# EAGLE design EspPinExtender (EAGLE 6.1)
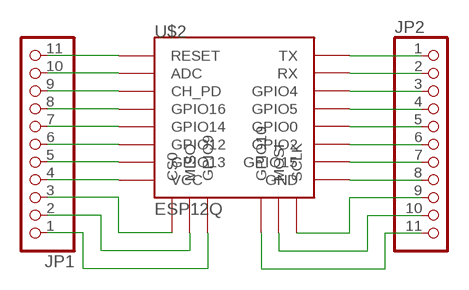
[diagram p0: schematic, sheet 1]

## Parts
JP1  PINHD-1X11  [1X11]
JP2  PINHD-1X11  [1X11]
U$2  ESP12Q  [ESP12Q]

## Nets
N$1: JP1.4 U$2.VCC
N$2: JP1.5 U$2.GPIO13
N$3: JP1.6 U$2.GPIO12
N$4: JP1.7 U$2.GPIO14
N$5: JP1.8 U$2.GPIO16
N$6: JP1.3 U$2.CS0
N$7: JP1.2 U$2.MISO
N$8: JP1.1 U$2.GPIO9
N$9: JP1.9 U$2.CH_PD
N$10: JP1.10 U$2.ADC
N$11: JP1.11 U$2.RESET
N$12: JP2.1 U$2.TX
N$13: JP2.2 U$2.RX
N$14: JP2.9 U$2.SCLK
N$15: JP2.10 U$2.MOSI
N$16: JP2.11 U$2.GPIO10
N$17: JP2.3 U$2.GPIO4
N$18: JP2.4 U$2.GPIO5
N$19: JP2.5 U$2.GPIO0
N$20: JP2.6 U$2.GPIO2
N$21: JP2.7 U$2.GPIO15
N$22: JP2.8 U$2.GND

## Library data of the parts
JP1 JP2 = pinhead:PINHD-1X11: PIN HEADER
U$2 = esp826612q:ESP12Q: ESP8266 Wifi module 12-Q

## Board
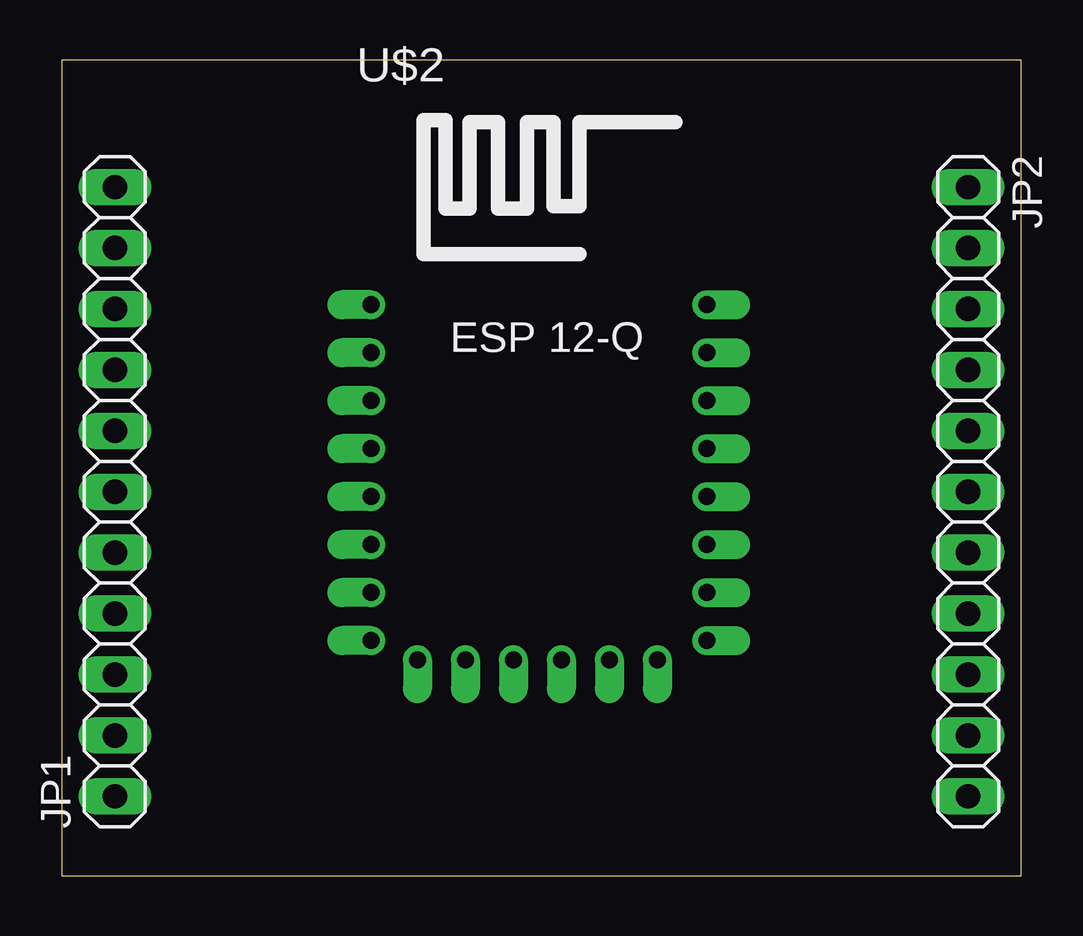
[diagram p1: board, top side]
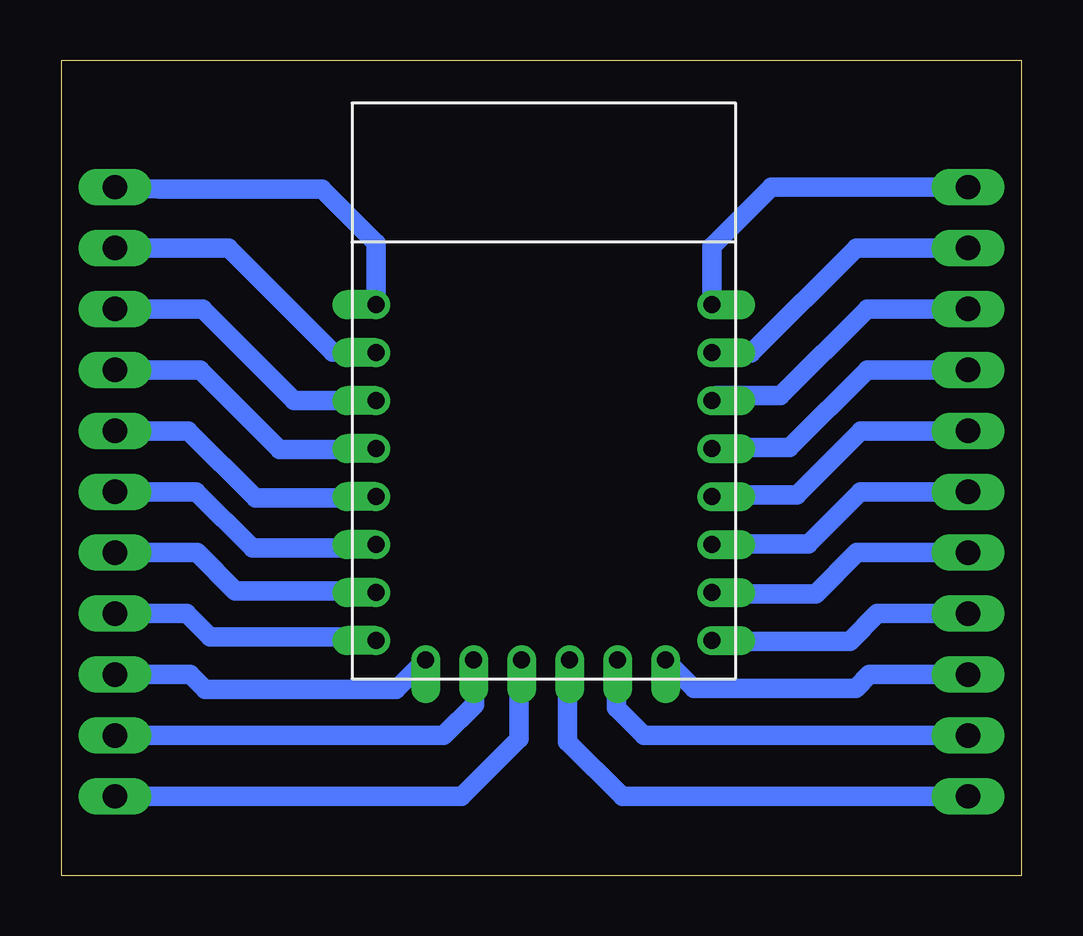
[diagram p2: board, bottom side, seen from below]

Size 40 x 34 mm. Coordinates in mm from the lower left corner, seen from the top.
Outline: 0,0 40,0 40,34 0,34 0,0
Copper layers (1*16): Top 0.035mm / dielectric 1.5mm / Bottom 0.035mm
Design rules: minimum track width 10mil, minimum drill 24mil, track to track 8mil, track to pad 8mil, pad to pad 8mil, via to via 8mil, smd to smd 8mil, copper to edge 40mil, drill to drill 8mil, minimum pad ring 10mil, minimum via ring 8mil, stop-mask expansion 4mil, vias tented up to drill 0mil, thermal gap 10mil

### Footprints (pad centres in the part's own frame; a part is rotated, then mirrored left to right if it is on the bottom)
1X11 = drill 1.016 long: 1 -12.7,0; 2 -10.16,0; 3 -7.62,0; 4 -5.08,0; 5 -2.54,0; 6 0,0; 7 2.54,0; 8 5.08,0; 9 7.62,0; 10 10.16,0; 11 12.7,0
ESP12Q = drill 0.7 offset: ADC -7.1,3.8; CH_PD -7.1,1.8; CS0 -5.165,-9.005; GND 6.9,-8.2; GPIO0 6.9,-2.2; GPIO2 6.9,-4.2; GPIO4 6.9,1.8; GPIO5 6.9,-0.2; GPIO9 -1.165,-9.005; GPIO10 0.835,-9.005; GPIO12 -7.1,-4.2; GPIO13 -7.1,-6.2; GPIO14 -7.1,-2.2; GPIO15 6.9,-6.2; GPIO16 -7.1,-0.2; MISO -3.165,-9.005; MOSI 2.835,-9.005; RESET -7.1,5.8; RX 6.9,3.8; SCLK 4.835,-9.005; TX 6.9,5.8; VCC -7.1,-8.2

### Placement (x,y rotation side)
JP1  2.22,16 90 top
JP2  37.79,16 270 top
U$2  20,18 0 top

### Tracks (layer width: path | path; a pad name or v marks a point on that pad's centre or on a via)
N$1
  Bottom 0.813: JP1.4 6,10.92 7.15,9.77 12.86,9.77 U$2.VCC
N$2
  Bottom 0.813: JP1.5 6.86,13.46 8.57,11.75 12.85,11.75 U$2.GPIO13
N$3
  Bottom 0.813: JP1.6 6.71,16 8.88,13.83 12.87,13.83 U$2.GPIO12
N$4
  Bottom 0.813: JP1.7 6.68,18.54 9.36,15.86 12.84,15.86 U$2.GPIO14
N$5
  Bottom 0.813: JP1.8 6.43,21.08 9.67,17.84 12.86,17.84 U$2.GPIO16
N$6
  Bottom 0.813: JP1.3 6.33,8.38 6.9,7.81 13.65,7.81 U$2.CS0
N$7
  Bottom 0.813: JP1.2 15.72,5.84 16.88,7 16.88,8.95 U$2.MISO
N$8
  Bottom 0.813: JP1.1 16.64,3.3 18.91,5.57 18.91,8.92 U$2.GPIO9
N$9
  Bottom 0.813: JP1.9 6.43,23.62 10.05,20 12.7,20 U$2.CH_PD
N$10
  Bottom 0.813: JP1.10 6.89,26.16 11.27,21.78 12.88,21.78 U$2.ADC
N$11
  Bottom 0.813: U$2.RESET 12.9,26.22 10.43,28.69 5.01,28.69 JP1.11
N$12
  Bottom 0.813: U$2.TX 26.9,26.36 29.15,28.61 35.91,28.61 JP2.1
N$13
  Bottom 0.813: JP2.2 33.05,26.16 28.72,21.83 26.93,21.83 U$2.RX
N$14
  Bottom 0.813: JP2.9 34.65,8.38 34.02,7.76 26.07,7.76 U$2.SCLK
N$15
  Bottom 0.813: JP2.10 24.08,5.84 22.8,7.12 22.8,8.96 U$2.MOSI
N$16
  Bottom 0.813: JP2.11 23.34,3.3 20.94,5.7 20.94,8.89 U$2.GPIO10
N$17
  Bottom 0.813: JP2.3 34.14,23.62 30.32,19.8 U$2.GPIO4
N$18
  Bottom 0.813: JP2.4 34.24,21.08 30.93,17.77 26.93,17.77 U$2.GPIO5
N$19
  Bottom 0.813: JP2.5 34.72,18.54 31.92,15.73 26.97,15.73 U$2.GPIO0
N$20
  Bottom 0.813: JP2.6 34.39,16 32.04,13.65 27.05,13.65 U$2.GPIO2
N$21
  Bottom 0.813: JP2.7 34.37,13.46 32.78,11.87 26.97,11.87 U$2.GPIO15
N$22
  Bottom 0.813: JP2.8 34.8,10.92 33.82,9.94 28.13,9.94 28.03,9.84 26.94,9.84 U$2.GND